# EAGLE design Sensor-HDC1008 (EAGLE 7.7.0)
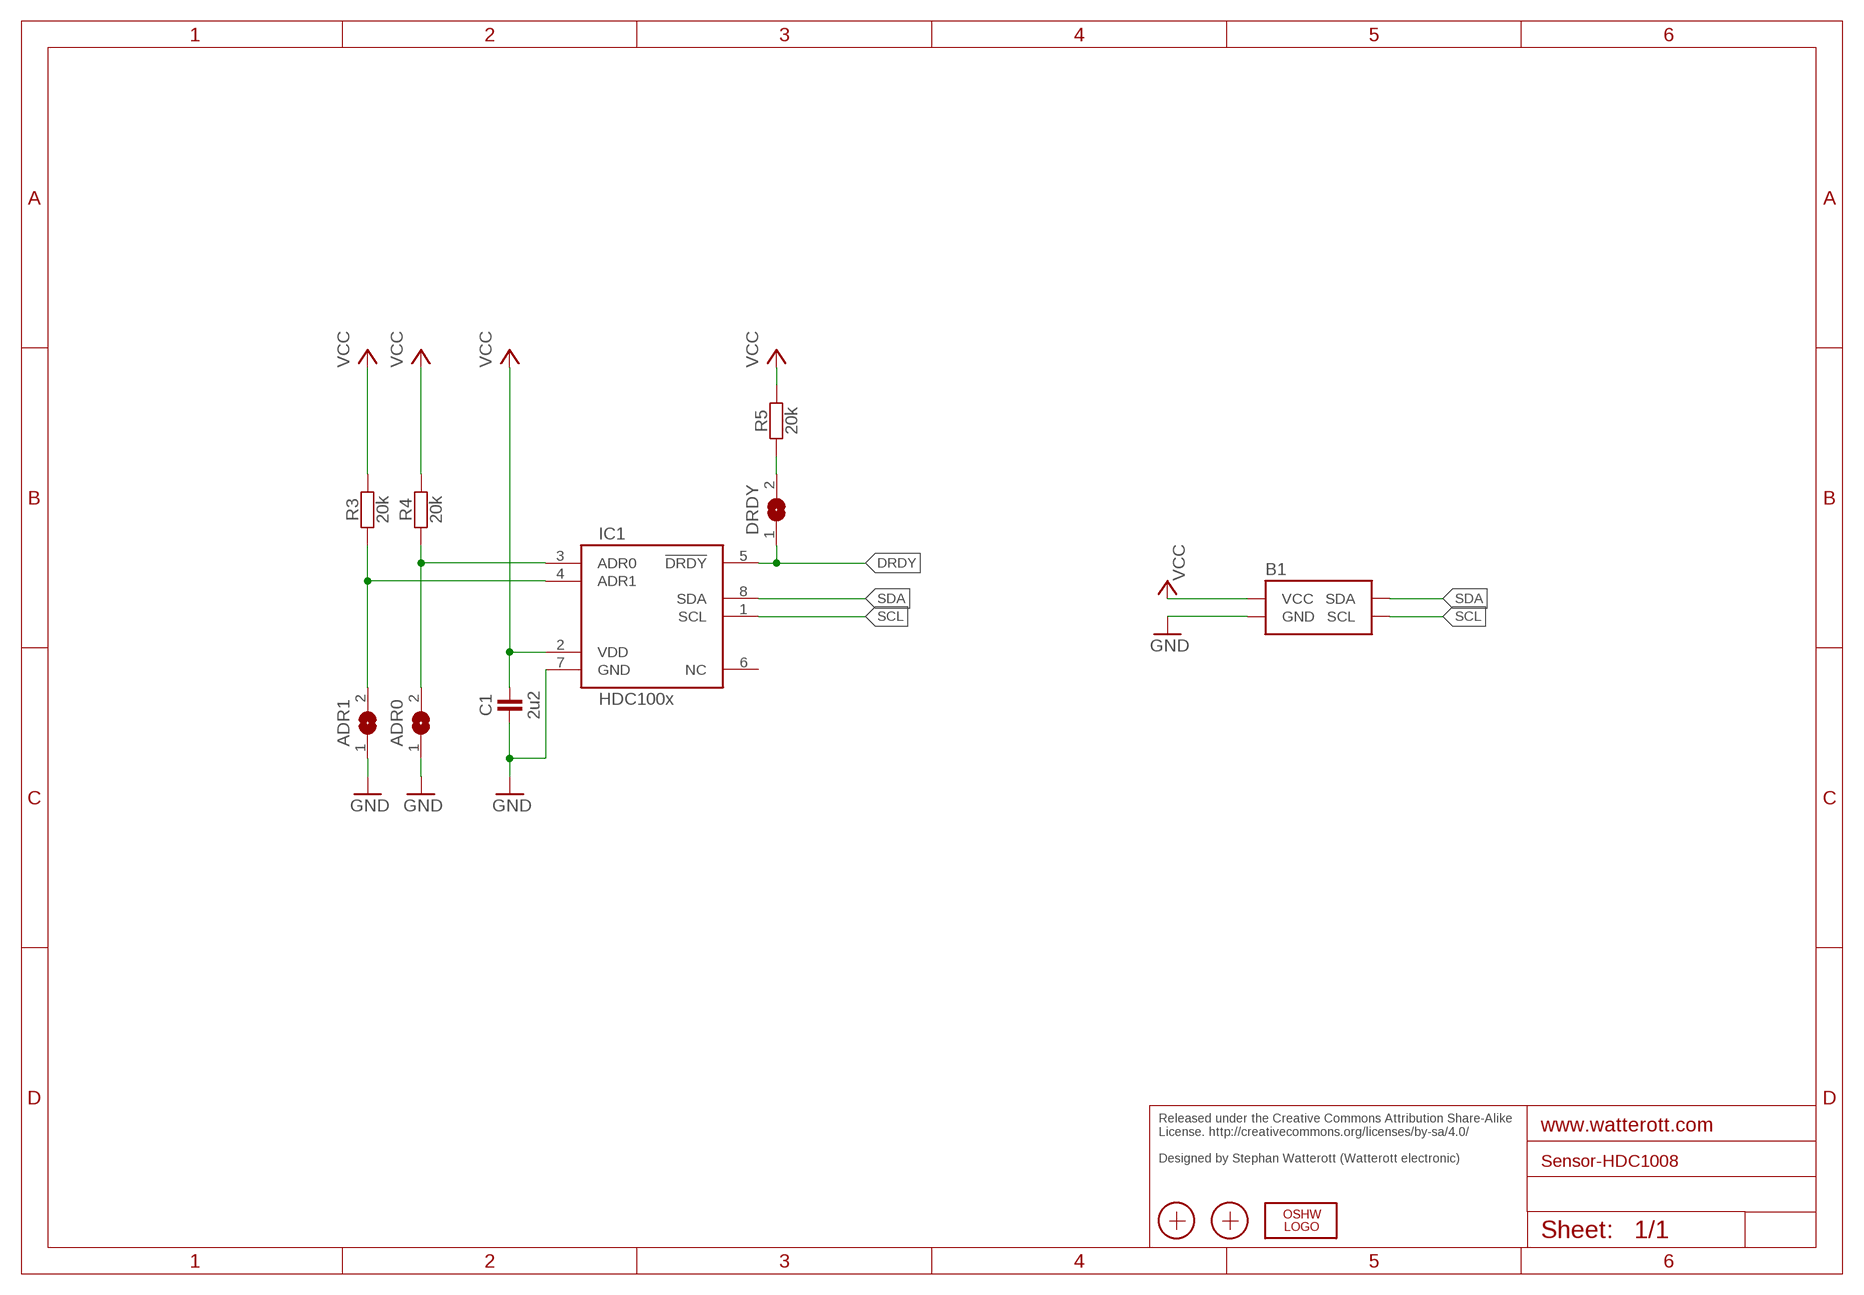
[diagram p0: schematic, sheet 1]

## Parts
ADR0  JUMPER2-0402  [JUMPER2-0402]
ADR1  JUMPER2-0402  [JUMPER2-0402]
B1  SENSEBOX_I2C  [SENSEBOX_I2C]
C1  2u2  CAPACITOR-C0402  [R0402]
DRDY  JUMPER2-0402  [JUMPER2-0402]
IC1  HDC100x  HDC1008  [WLCSP]
LOGO2  OSHW_LOGOX0070  [OSHW_6X70]
R3  20k  RESISTOR-R0402  [R0402]
R4  20k  RESISTOR-R0402  [R0402]
R5  20k  RESISTOR-R0402  [R0402]
X1  PASSER-07  [PASSER_07MM]
X2  PASSER-07  [PASSER_07MM]

## Nets
ADR0: ADR0.2 IC1.3(ADR0) R4.1
ADR1: ADR1.2 IC1.4(ADR1) R3.1
DRDY: DRDY.1 IC1.5(!DRDY)
GND: ADR0.1 ADR1.1 B1.GND C1.1 IC1.7(GND)
N$3: DRDY.2 R5.1
SCL: B1.SCL IC1.1(SCL)
SDA: B1.SDA IC1.8(SDA)
VCC: B1.VCC C1.2 IC1.2(VDD) R3.2 R4.2 R5.2
Unconnected: IC1.6(NC)

## Notes on the sheet
- Released under the Creative Commons Attribution Share-Alike 
  License. http://creativecommons.org/licenses/by-sa/4.0/
  
  Designed by Stephan Watterott (Watterott electronic)

## Library data of the parts
ADR0 ADR1 DRDY = we-rcl:JUMPER2: 2 Pin Jumpers
B1 = we-board:SENSEBOX_I2C: SenseBox Sensors/Breakouts
C1 = we-rcl:CAPACITOR: Capacitors ...4.7uF @ 6.3V -> 0402 ...10uF @ 16V -> 0603 ...22uF @ 25V -> 0805
IC1 = we-chip:HDC1008: TI HDC1008 Integrated Low Power Digital Humidity Sensor with Integrated Temperature Sensor; DIGIKEY: 296-38440
LOGO2 = we-symbol:OSHW_LOGO: Open-Source-Hardware Logo
R3-R5 = we-rcl:RESISTOR: Resistors all kinds in 0603 and 0402
X1 X2 = we-symbol:PASSER: Fiducial Markers

## Board
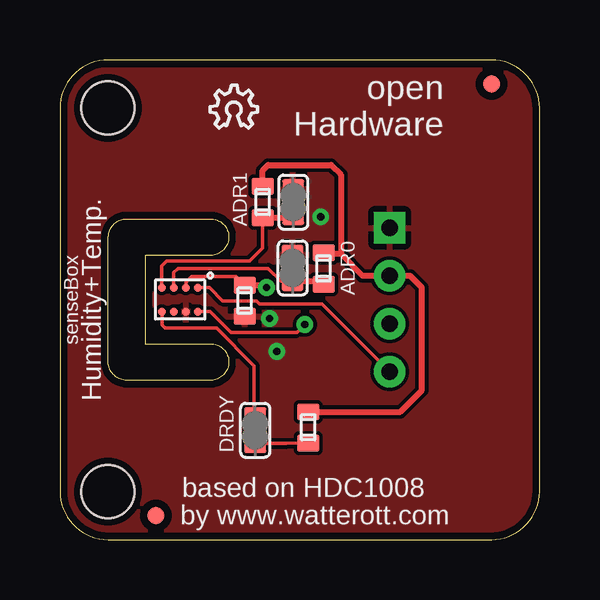
[diagram p1: board, top side]
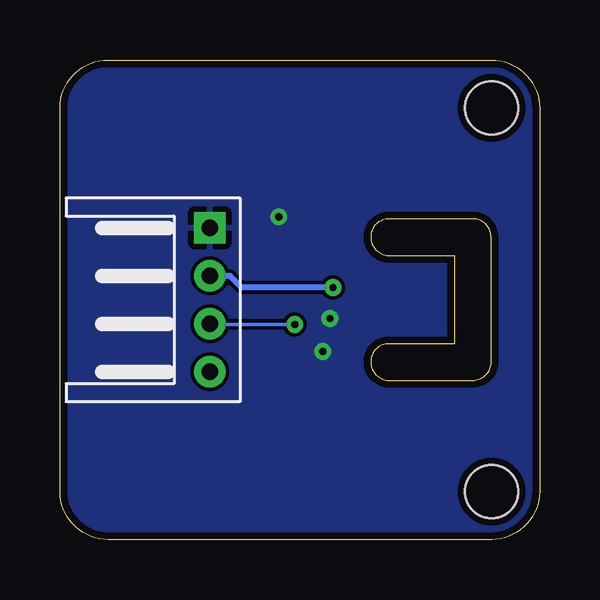
[diagram p2: board, bottom side, seen from below]

Size 20 x 20 mm. Coordinates in mm from the lower left corner, seen from the top.
Outline: 6.27,6.64 6.21,6.64
Outline: 6.21,6.64 2.72,6.64 arc-90 2.02,7.47 2.02,12.61 arc-90 2.78,13.37 6.34,13.37 arc-180 6.21,11.85 3.54,11.85 3.54,8.17 6.34,8.17 arc-180 6.21,6.64
Copper layers (1*16): Top 0.035mm / dielectric 1.5mm / Bottom 0.035mm
Design rules "we-dru-2-layer *": minimum track width 0.15mm, minimum drill 0.3mm, track to track 0.15mm, track to pad 0.15mm, pad to pad 0.15mm, via to via 0.15mm, smd to smd 0.1mm, copper to edge 0.3mm, drill to drill 0.2mm, minimum pad ring 0.18mm, minimum via ring 0.2mm, stop-mask expansion 0.1mm, vias tented up to drill 0.5mm, thermal gap 0.25mm

### Footprints (pad centres in the part's own frame; a part is rotated, then mirrored left to right if it is on the bottom)
JUMPER2-0402 = smd 0.9 x 0.8: 1 0,0.55; 2 0,-0.55
SENSEBOX_I2C = drill 0.7 pad 1.3 square: GND 13.75,13 | drill 0.7 pad 1.3: SCL 13.75,7; SDA 13.75,9; VCC 13.75,11 | hole 2.2: 2,18; 2,2
R0402 = smd 0.9 x 0.7: 1 0,0.65; 2 0,-0.65
WLCSP = smd 0.335 x 0.335: 1 -0.5,0.75; 2 -0.5,0.25; 3 -0.5,-0.25; 4 -0.5,-0.75; 5 0.5,-0.75; 6 0.5,-0.25; 7 0.5,0.25; 8 0.5,0.75
PASSER_07MM = smd 0.7 x 0.7: X 0,0

### Placement (x,y rotation side)
ADR0  9.7,11.33 0 top
ADR1  9.73,14.07 0 top
B1  0,0 0 top
C1  7.71,9.96 180 top
DRDY  8.14,4.56 0 top
IC1  5,10.01 270 top
LOGO2  6.26,17.16 0 top
R3  8.46,14.07 180 top
R4  11,11.3 180 top
R5  10.35,4.67 180 top
X1  18,19 0 top
X2  4,1 0 top

### Tracks (layer width: path | path; a pad name or v marks a point on that pad's centre or on a via)
ADR0
  Top 0.152: ADR0.2 9.21,10.78 8.69,11.3 4.93,11.3 4.75,11.12 IC1.3
  Top 0.254: ADR0.2 10.87,10.78 R4.1
ADR1
  Top 0.152: IC1.4 4.24,11.4 4.45,11.61 7.9,11.61 8.46,12.17 R3.1
  Top 0.254: R3.1 9.63,13.42 ADR1.2
DRDY
  Top 0.152: IC1.5 4.25,8.95 4.39,8.81 6.53,8.81 8.1,7.24 8.1,5.15 DRDY.1
GND  (via drill 0.3)
  other vias: 9.04,7.85 8.74,9.22 10.87,13.46
  pour Top: 0,0 20,0 20,20 0,20
  pour Bottom: 0,0 20,0 20,20 0,20
N$3
  Top 0.152: DRDY.2 9.42,4.01 R5.1
SCL
  Top 0.152: IC1.1 6.23,10.51 6.78,9.96 8.2,9.96 8.33,9.83 10.92,9.83 B1.SCL
SDA  (via drill 0.3)
  Top 0.152: IC1.8 6.27,9.51 7.14,8.64 9.88,8.64 v10.21,8.97
  Bottom 0.152: v10.21,8.97 13.72,8.97 B1.SDA
VCC  (via drill 0.3)
  Top 0.152: IC1.2 5.25,10.74 5.49,10.97 7.34,10.97 C1.2
  Top 0.254: 11.71,11.91 12.62,11 B1.VCC 14.61,11 15.09,10.52 15.09,6.22 14.19,5.32 R5.2 | 11.71,11.91 11.04,11.91 R4.2 10.97,11.98 | R3.2 8.46,15.39 8.69,15.62 11.3,15.62 11.71,15.21 11.71,11.91 | C1.2 8.52,10.61 v8.61,10.52
  Bottom 0.254: v8.61,10.52 12.42,10.52 12.9,11 B1.VCC

### Text on the board
tPlace: open / Hardware | ADR1 | senseBox | Humidity+Temp. | ADR0 | DRDY | based on HDC1008 | by www.watterott.com